# Altium project 2002_B_CapteurMeteoWifi.PrjPcb
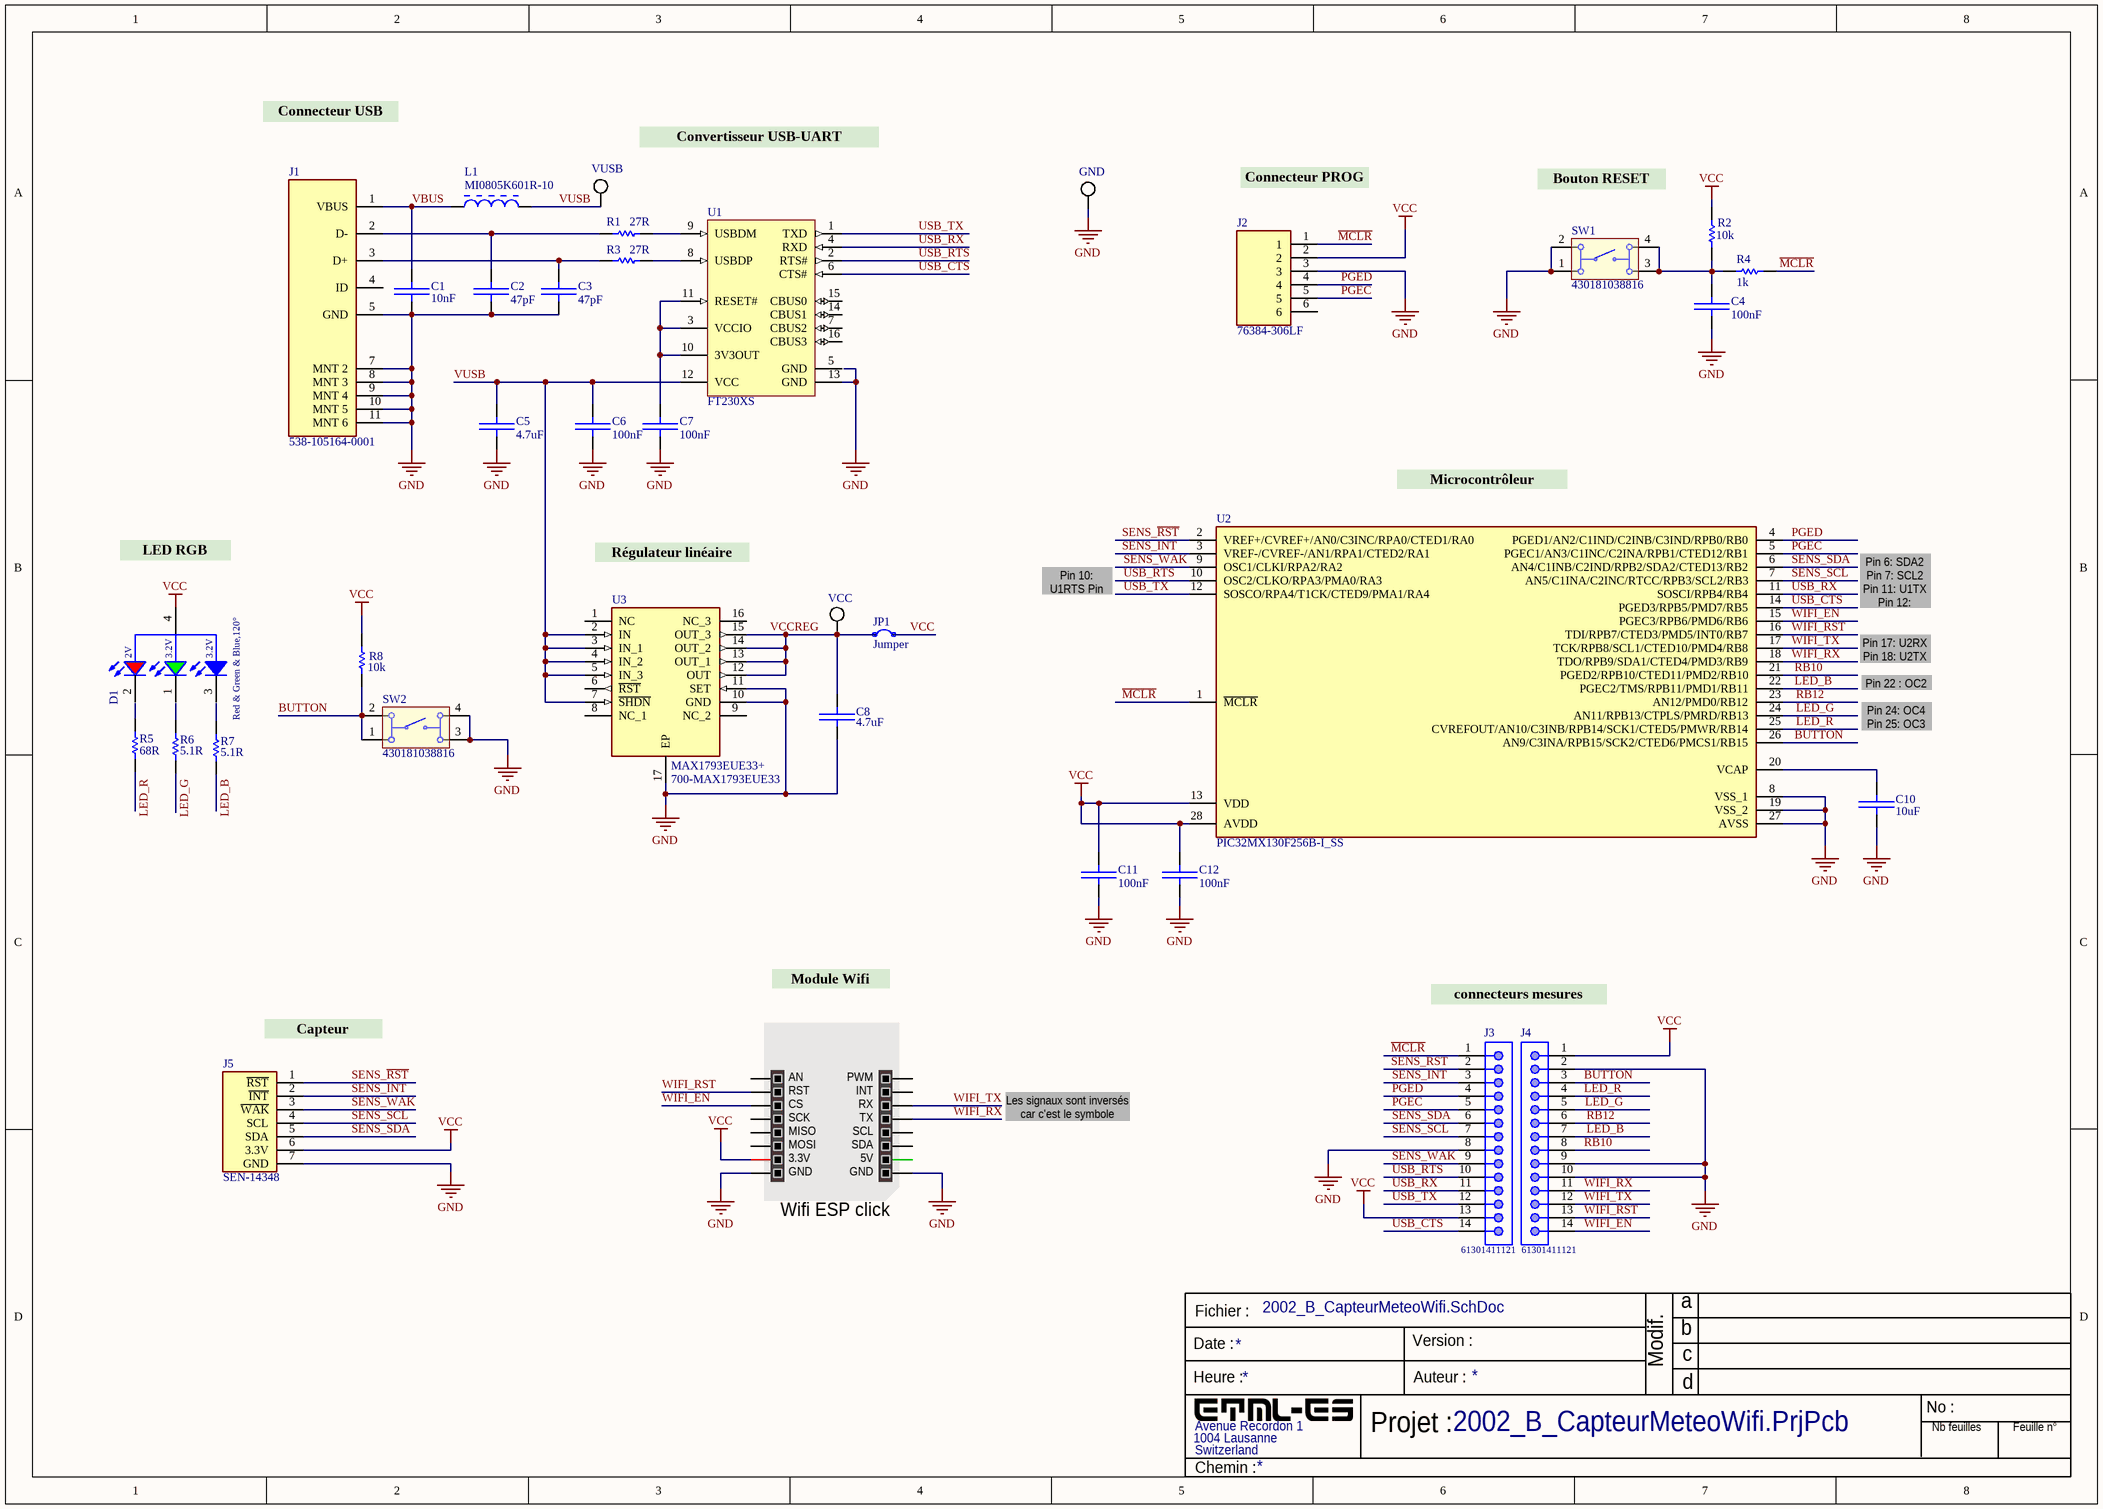
[diagram p0: 2002_B_CapteurMeteoWifi.SchDoc]
1 sheet, 36 parts. Net scope: global (net labels, ports and power ports of the same name join across sheets).
Board file: 2002_B_CapteurMeteoWifi.PcbDoc

## Sheet 2002_B_CapteurMeteoWifi.SchDoc
size A3; Organization: ETML-ES; Address1: Avenue Recordon 1; Address2: 1004 Lausanne; Address3: Switzerland

### Parts
C1  value 10nF  [LIRD-MI0805K601R-10-2_V]  (hidden comment: Condensator)
C2  value 47pF  [LIRD-MI0805K601R-10-2_V]  (hidden comment: Condensator)
C3  value 47pF  [LIRD-MI0805K601R-10-2_V]  (hidden comment: Condensator)
C4  value 100nF  [LIRD-MI0805K601R-10-2_V]  (hidden comment: Condensator)
C5  value 4.7uF  [LIRD-MI0805K601R-10-2_V]  (hidden comment: Condensator)
C6  value 100nF  [LIRD-MI0805K601R-10-2_V]  (hidden comment: Condensator)
C7  value 100nF  [LIRD-MI0805K601R-10-2_V]  (hidden comment: Condensator)
C8  value 4.7uF  [LIRD-MI0805K601R-10-2_V]  (hidden comment: Condensator)
C10  value 10uF  [LIRD-MI0805K601R-10-2_V]  (hidden comment: Condensator)
C11  value 100nF  [LIRD-MI0805K601R-10-2_V]  (hidden comment: Condensator)
C12  value 100nF  [LIRD-MI0805K601R-10-2_V]  (hidden comment: Condensator)
D1  Red & Green & Blue,120°  [150066M153000]
GND  5019  [TESTPOINT_SMD]  (value not drawn)
J1  Supplier Part Number 1: 538-105164-0001  [Molex_105164-0001_0]  (hidden comment: 105164-0001)
J2  76384-306LF  [SHDR6W62P0X254_1X6_1424X460X934P]
J3  61301411121  [61301411121]
J4  61301411121  [61301411121]
J5  SEN-14348  [SEN-14193]
JP1  Jumper  [connector_2PIN]
L1  MI0805K601R-10  [LIRD-MI0805K601R-10-2_V]
R1  value 27R  [LIRD-MI0805K601R-10-2_V]  (hidden comment: Resistor)
R2  value 10k  [LIRD-MI0805K601R-10-2_V]  (hidden comment: Resistor)
R3  value 27R  [LIRD-MI0805K601R-10-2_V]  (hidden comment: Resistor)
R4  value 1k  [LIRD-MI0805K601R-10-2_V]  (hidden comment: Resistor)
R5  value 68R  [LIRD-MI0805K601R-10-2_V]  (hidden comment: Resistor)
R6  value 5.1R  [LIRD-MI0805K601R-10-2_V]  (hidden comment: Resistor)
R7  value 5.1R  [LIRD-MI0805K601R-10-2_V]  (hidden comment: Resistor)
R8  value 10k  [LIRD-MI0805K601R-10-2_V]  (hidden comment: Resistor)
SW1  430181038816  [430181038816]
SW2  430181038816  [430181038816]
U1  FT230XS  [FTDI-SSOP-16_L]
U2  PIC32MX130F256B-I_SS  [SOP65P780X200-28N]
U3  MAX1793EUE33+  Supplier Part Number 1: 700-MAX1793EUE33  [SOP65P638X110-17N]
VCC  5019  [TESTPOINT_SMD]  (value not drawn)
VUSB  5019  [TESTPOINT_SMD]  (value not drawn)
Wifi_ESP_click  MIKROBUS HOST CONN.  [MIKROBUS HOST CONN.]  (value not drawn)

### Nets
GND: C1.2 C2.2 C3.2 C4.2 C5.2 C6.2 C7.2 C8.2 C10.2 C11.2 C12.2 GND.1 J1.5(GND) J1.7(MNT_2) J1.8(MNT_3) J1.9(MNT_4) J1.10(MNT_5) J1.11(MNT_6) J2.3 J3.8 J4.2 J4.9 J4.10 J5.7(GND) SW1.1 SW1.2 SW2.3 SW2.4 U1.13(GND) U2.8(VSS_1) U2.19(VSS_2) U2.27(AVSS) U3.10(GND) U3.11(SET) U3.17(EP) Wifi_ESP_click.8(GND) Wifi_ESP_click.9(GND)
VCC: C11.1 C12.1 J2.2 J3.13 J4.1 J5.6(3.3V) JP1.2 R2.2 R8.2 U2.13(VDD) U2.28(AVDD) Wifi_ESP_click.7(3.3V)
BUTTON: J4.3 R8.1 SW2.1 SW2.2 U2.26(AN9/C3INA/RPB15/SCK2/CTED6/PMCS1/RB15)
LED_B: J4.7 R7.1 U2.22(PGEC2/TMS/RPB11/PMD1/RB11)
LED_G: J4.5 R6.1 U2.24(AN11/RPB13/CTPLS/PMRD/RB13)
LED_R: J4.4 R5.1 U2.25(CVREFOUT/AN10/C3INB/RPB14/SCK1/CTED5/PMWR/RB14)
~{MCLR}: J2.1 J3.1 R4.1 U2.1(~{MCLR})
PGEC: J2.5 J3.5 U2.5(PGEC1/AN3/C1INC/C2INA/RPB1/CTED12/RB1)
PGED: J2.4 J3.4 U2.4(PGED1/AN2/C1IND/C2INB/C3IND/RPB0/RB0)
RB10: J4.8 U2.21(PGED2/RPB10/CTED11/PMD2/RB10)
RB12: J4.6 U2.23(AN12/PMD0/RB12)
SENS_~{INT}: J3.3 J5.2(~{INT}) U2.3(VREF-/CVREF-/AN1/RPA1/CTED2/RA1)
SENS_~{RST}: J3.2 J5.1(~{RST}) U2.2(VREF+/CVREF+/AN0/C3INC/RPA0/CTED1/RA0)
SENS_SCL: J3.7 J5.4(SCL) U2.7(AN5/C1INA/C2INC/RTCC/RPB3/SCL2/RB3)
SENS_SDA: J3.6 J5.5(SDA) U2.6(AN4/C1INB/C2IND/RPB2/SDA2/CTED13/RB2)
SENS_~{WAK}: J3.9 J5.3(~{WAK}) U2.9(OSC1/CLKI/RPA2/RA2)
USB_CTS: J3.14 U1.6(CTS#) U2.14(PGED3/RPB5/PMD7/RB5)
USB_RTS: J3.10 U1.2(RTS#) U2.10(OSC2/CLKO/RPA3/PMA0/RA3)
USB_RX: J3.11 U1.4(RXD) U2.11(SOSCI/RPB4/RB4)
USB_TX: J3.12 U1.1(TXD) U2.12(SOSCO/RPA4/T1CK/CTED9/PMA1/RA4)
VBUS: C1.1 J1.1(VBUS) L1.1
VCCREG: C8.1 JP1.1 U3.12(OUT) U3.13(OUT_1) U3.14(OUT_2) U3.15(OUT_3) VCC.1
VUSB: C5.1 C6.1 L1.2 U1.12(VCC) U3.2(IN) U3.3(IN_1) U3.4(IN_2) U3.5(IN_3) U3.7(~{SHDN}) VUSB.1
WIFI_EN: J4.14 U2.15(PGEC3/RPB6/PMD6/RB6) Wifi_ESP_click.3(CS)
WIFI_RST: J4.13 U2.16(TDI/RPB7/CTED3/PMD5/INT0/RB7) Wifi_ESP_click.2(RST)
WIFI_RX: J4.11 U2.18(TDO/RPB9/SDA1/CTED4/PMD3/RB9) Wifi_ESP_click.13(TX)
WIFI_TX: J4.12 U2.17(TCK/RPB8/SCL1/CTED10/PMD4/RB8) Wifi_ESP_click.14(RX)
NetC2_1: C2.1 J1.2(D-) R1.1
NetC3_1: C3.1 J1.3(D+) R3.1
NetC4_1: C4.1 R2.1 R4.2 SW1.3 SW1.4
NetC7_1: C7.1 U1.3(VCCIO) U1.10(3V3OUT) U1.11(RESET#)
NetC10_1: C10.1 U2.20(VCAP)
NetR1_2: R1.2 U1.9(USBDM)
NetR3_2: R3.2 U1.8(USBDP)

Not connected (* = marked no-connect by the designer): D1 1(K) 2(K) 3(A) 4(K); J1 4(ID); J2 6; R5 2; R6 2; R7 2; U1 5(GND) 7(CBUS2) 14(CBUS1) 15(CBUS0) 16(CBUS3); U3 1(NC) 6(~{RST}) 8(NC_1) 9(NC_2) 16(NC_3); Wifi_ESP_click 1(AN) 4(SCK) 5(MISO) 6(MOSI) 10(5V) 11(SDA) 12(SCL) 15(INT) 16(PWM)

### Notes on the sheet
- Connecteur USB
- Convertisseur USB-UART
- Connecteur PROG
- Bouton RESET
- (near U2) Microcontrôleur
- LED RGB
- Régulateur linéaire
- Pin 6: SDA2  Pin 7: SCL2
- Pin 10: U1RTS Pin 12: U1RX
- Pin 11: U1TX Pin 12: U1CTS
- Pin 17: U2RX Pin 18: U2TX
- Pin 22 : OC2
- Pin 24: OC4  Pin 25: OC3
- Module Wifi
- (near J5) Capteur
- connecteurs mesures
- Les signaux sont inversés car c'est le symbole "HOST"
- Fichier :
- a
- Date :
- Heure :
- Version :
- Auteur :
- Modif.
- b
- c
- d
- Projet :
- No :
- Nb feuilles
- Feuille n°
- Chemin :
- Labels drawn without touching a wire or pin: VCC
- (in symbol APHF1608LSEEQBDZGKC) 2V; 3.2V

### Library data of the parts
C1-C8 C10-C12 = Condensator: 0805 Condensator
D1 = APHF1608LSEEQBDZGKC: DEL standard - CMS RGB 0603 SMD; Forward Voltage: 3.3 V@Blue, 3.3 V@Green, 2 V@Red; Peak Wavelength: 468 nm@Blue, 520 nm@Green, 632 nm@Red; Dominant Wavelength: 470 nm@Blue, 525 nm@Green, 624 nm@Red; Luminous Intensity: 180 mcd@Blue, 900 mcd@Green, 285 mcd@Red; ComponentLink1Description: Manufacturer; ComponentLink1URL: http://www.we-online.de; ComponentLink2Description: Datasheet; ComponentLink2URL: http://katalog.we-online.de/led/datasheet/150066M153000.pdf; Part Number: 150066M153000; Published Date: May 2018; Publisher: Wurth Elektronik; Size: 0606; Viewing Angle: 120°; Operating Temperature: -40 to 85 degC; Emitting Color: Red & Green & Blue; Mounting Technology: SMT
GND VCC VUSB = TESTPOINT: Test point smd
J1 = 105164-0001: Connecteurs USB MICRO USB B RECEPT TOP MOUNT; Supplier 1: Mouser
J2 = 76384-306LF: Connector; Manufacturer_Name: Amphenol; Datasheet Link: https://www.mouser.co.uk/datasheet/2/18/76384-1363448.pdf; Height: 9.34mm; Manufacturer_Part_Number: 76384-306LF
J3 J4 = 61301411121: WR-PHD Pin Header, THT, pitch 2.54mm, Single Row, Vertical, 14pin; Pin Number: 14; Gender: Male; Rated Current: 3A; Working Voltage: 250VAC; Withstanding Voltage: 500VAC; Contact Resistance: 20mOhm; ComponentLink1Description: Manufacturer; ComponentLink1URL: http://www.we-online.de; ComponentLink2Description: Datasheet; ComponentLink2URL: https://katalog.we-online.de/em/datasheet/6130xx11121.pdf; Part Number: 61301411121; Published Date: June 2019; Publisher: Wurth Elektronik; Pitch: 2.54mm; Operating Temperature: -40 to +105degC; Mounting Technology: THT; Packaging: Bag; Row Number: Single; Orientation: Vertical
J5 = SEN-14193: CCS811 kit; Manufacturer_Name: Amphenol; Manufacturer_Part_Number: 68604-804HLF; Datasheet Link: https://componentsearchengine.com/Datasheets/1/68604-804HLF.pdf; Height: 12.39mm; Mouser2 Part Number: 649-68604-804HLF; Mouser2 Price/Stock: https://www.mouser.com/Search/Refine.aspx?Keyword=649-68604-804HLF
L1 = CMP-2000-05196-1: Chip Bead for Power Filtering, 1500 mA, 600 Ohm, -40 to 125 degC, 0805 (2012 Metric), RoHS, Tape and Reel; Manufacturer: Laird; Filter Type: PowerLine; Current Rating (Max): 1.5A; Catalog Drawings: (HI,HZ,LI,MI)0805Series_1.10mmMax.Height; Impedance @ Frequency: 600Ohm@100MHz; Number of Lines: 1; DC Resistance (DCR) (Max): 100mOhm; Other Names: 240-2390-1; Kits: 240-2227-ND-KITEMIFERRITEBEADCHIPSMD; Online Catalog: MISeries; Standard Package: 1; Datasheet Version: Rev. A, 01/2004; Height (Max): 0.043"(1.10mm); Category: Filters; Operating Temperature: -40degC~125degC; Package Description: 2-Pin Surface Mount Device, Body 2 x 1.25 mm; Package / Case: 0805(2012Metric); Package Reference: MI0805K601R-10-2; Packaging: CutTape(CT); Ratings: -; Mounting Type: SurfaceMount; Datasheet URL: https://datasheet.ciiva.com/3082/mi0805k601r-10-a-vp-3082219.pdf; Size / Dimension: 0.079"Lx0.049"W(2.00mmx1.25mm); Family: FerriteBeadsandChips; Manufacturer URL: https://www.lairdtech.com; Series: MI; Supplier: Digikey; Supplier Ref.: 240-2390-1-ND; Supplier min. qty: 1; Supplier unit price: 0.11
R1-R8 = Resistor: 0805 Resistor
SW1 SW2 = 430181038816: WS-TASV SMD Tact Switch 4.5X4.5 mm; Manufacturer: Wuerth Elektronik; NoPins: 04; ComponentLink1Description: Manufacturer URL; ComponentLink2Description: Datasheet; ComponentLink1URL: http://www.we-online.com; PartNumber: 430181038816; PackageReference: 430181038816; ComponentLink2URL: http://katalog.we-online.de/em/datasheet/430181038816.pdf
U1 = CMP-2000-06288-1: USB to Basic UART IC, 2.97 to 5.5 V, -40 to 85 degC, 16-Pin SSOP, RoHS; Manufacturer: FTDI; Data Rate: 3Mbaud; USB Standard: USB2.0; USB Type: Transceiver; No. of Pins: 16Pins; Supply Voltage Max: 5.5V; SVHC: NoSVHC(17-Dec-2015); Supply Voltage Min: 2.97V; MSL: MSL3-168hours; Datasheet Version: Rev. 1.4, 05/2016; Interface Case Style: SSOP; Datasheet URL: http://www.ftdichip.com/Support/Documents/DataSheets/ICs/DS_FT230X.pdf; Packaging: CutTape; Package Description: 16-Pin Shrink Small Outline Package Integrated Circuit, Body 4.9 x 3.9 mm, Pitch 0.635 mm; Operating Temperature Min: -40°C; Mounting Technology: SurfaceMount; Package Reference: SSOP-16; Manufacturer URL: http://www.ftdichip.com/; Product Range: -; Operating Temperature Max: 85°C; No. of Ports: -; Supplier: Digikey; Supplier Ref.: 768-1135-1-ND; Supplier min. qty: 1; Supplier unit price: 2.00
U2 = PIC32MX130F256B-I_SS: Integrated Circuit; Manufacturer_Name: Microchip; Manufacturer_Part_Number: PIC32MX130F256B-I/SS; Datasheet Link: https://componentsearchengine.com/Datasheets/1/PIC32MX130F256B-I_SS.pdf; Height: 2mm; Mouser Part Number: 579-MX130F256BISS; Mouser Price/Stock: https://www.mouser.com/Search/Refine.aspx?Keyword=579-MX130F256BISS; RS Part Number: 8806720P; RS Price/Stock: http://uk.rs-online.com/web/p/products/8806720P
U3 = MAX1793EUE33+: Integrated Circuit; Manufacturer_Name: Maxim Integrated; Datasheet Link: http://datasheets.maximintegrated.com/en/ds/MAX1793.pdf; Height: 1.1mm; Manufacturer_Part_Number: MAX1793EUE33+; Supplier 1: Mouser
Wifi_ESP_click = MIKROBUS HOST CONN._1: mikroBUS Host Socket; SMD: No